# EAGLE schematic external (EAGLE 6.4)
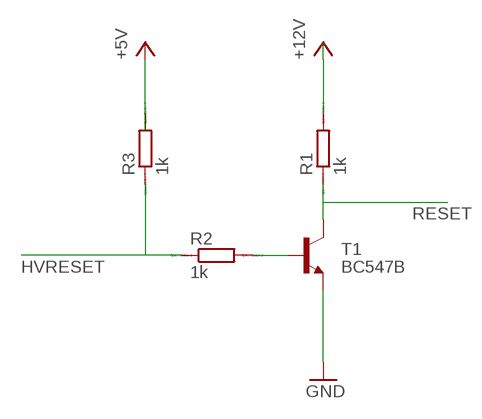
[diagram p0: schematic, sheet 1]

## Parts
R1  1k  R  [R0805]
R2  1k  R  [R0805]
R3  1k  R  [R0805]
T1  BC547B  BC547  [TO92]

## Nets
GND: T1.1(E)
HVRESET: R2.1
N$1: R2.2 T1.2(B)
N$2: R3.1
N$3: R1.1 T1.3(C)
VCC: R1.2 R3.2 ; supply symbol labelled +12V, +5V

## Library data of the parts
R1-R3 = eagle-ltspice:R: RESISTOR, European symbol; SPICEMODEL: NONE; SPICEPREFIX: R
T1 = transistor:BC547: NPN TRANSISTOR